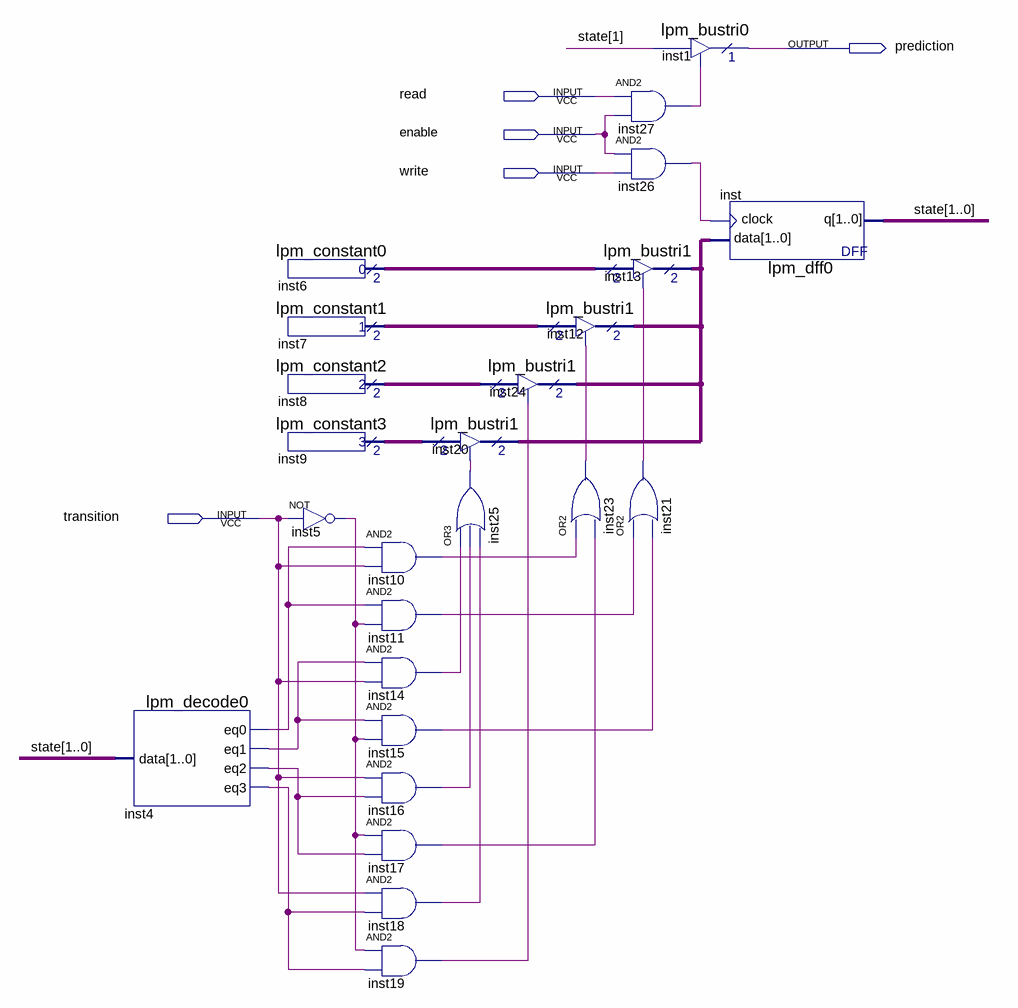
[diagram p0: schematic sheet]
// Quartus schematic A5.bdf as structural Verilog: 25 symbols, 5 pins
module A5 (
  input  read,
  input  enable,
  input  write,
  input  transition,
  output prediction
);

  wire inst4_eq0, inst4_eq1, inst4_eq2, inst4_eq3, inst5_out, inst10_out, inst11_out, inst14_out, inst15_out,
       inst16_out, inst17_out, inst18_out, inst19_out, inst21_out, inst23_out, inst25_out, inst26_out,
       inst27_out;
  wire [1:0] inst6_result, inst7_result, inst8_result, inst9_result, inst20_tridata, state;

  lpm_decode0 inst4 (.data(state), .eq0(inst4_eq0), .eq1(inst4_eq1), .eq2(inst4_eq2), .eq3(inst4_eq3));
  lpm_constant0 inst6 (.result(inst6_result));
  lpm_constant1 inst7 (.result(inst7_result));
  lpm_constant2 inst8 (.result(inst8_result));
  lpm_constant3 inst9 (.result(inst9_result));
  not inst5 (inst5_out, transition);
  and inst10 (inst10_out, inst4_eq0, transition);
  and inst11 (inst11_out, inst4_eq0, inst5_out);
  and inst14 (inst14_out, inst4_eq1, transition);
  and inst15 (inst15_out, inst4_eq1, inst5_out);
  and inst16 (inst16_out, transition, inst4_eq2);
  and inst17 (inst17_out, inst5_out, inst4_eq2);
  and inst18 (inst18_out, transition, inst4_eq3);
  and inst19 (inst19_out, inst5_out, inst4_eq3);
  lpm_bustri1 inst20 (.enabledt(inst25_out), .data(inst9_result), .tridata(inst20_tridata));
  or inst25 (inst25_out, inst14_out, inst16_out, inst18_out);
  lpm_bustri1 inst24 (.enabledt(inst19_out), .data(inst8_result), .tridata(inst20_tridata));
  lpm_bustri1 inst13 (.enabledt(inst21_out), .data(inst6_result), .tridata(inst20_tridata));
  lpm_bustri1 inst12 (.enabledt(inst23_out), .data(inst7_result), .tridata(inst20_tridata));
  or inst23 (inst23_out, inst10_out, inst17_out);
  lpm_bustri0 inst1 (.enabledt(inst27_out), .data(state[1]), .tridata(prediction));
  and inst27 (inst27_out, read, enable);
  and inst26 (inst26_out, enable, write);
  or inst21 (inst21_out, inst11_out, inst15_out);
  lpm_dff0 inst (.data(inst20_tridata), .clock(inst26_out), .q(state));
endmodule
